# EAGLE design shield due 7 (EAGLE 7.2.0)

## Sheet 1 of 8
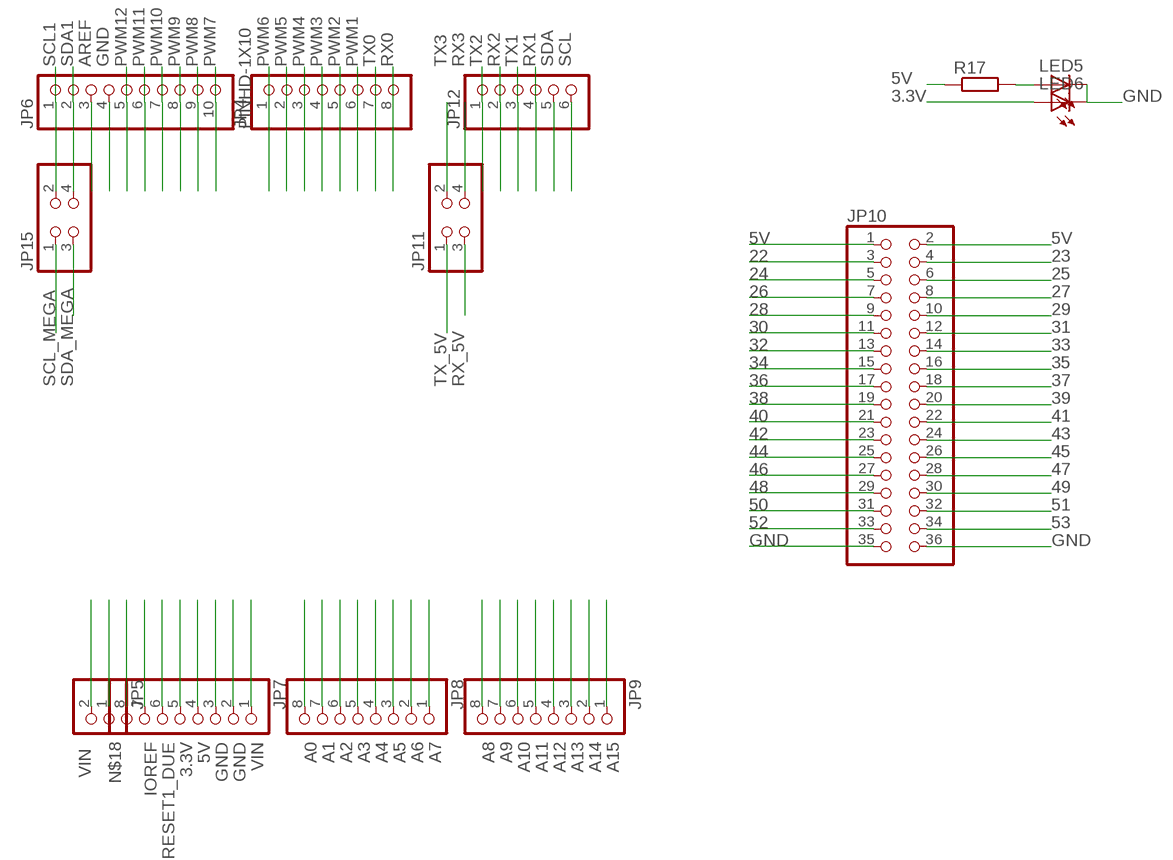
[diagram p0: schematic, sheet 1]

### Parts
JP4  PINHD-1X8  [1X08]
JP5  PINHD-1X2  [1X02]
JP6  PINHD-1X10  [1X10-BIG]
JP7  PINHD-1X8  [1X08]
JP8  PINHD-1X8BIG  [1X08-BIG]
JP9  PINHD-1X8BIG  [1X08-BIG]
JP10  PINHD-2X18  [2X18]
JP11  PINHD-2X2  [2X02]
JP12  PINHD-1X6  [1X06]
JP15  PINHD-2X2  [2X02]
LED5  LEDCHIPLED_0805  [CHIPLED_0805]
LED6  LEDCHIPLED_0805  [CHIPLED_0805]
R17  R-EU_R0805W  [R0805W]

### Nets
3.3V: JP7.5 LED6.A ; also sheet 3,4,7
5V: JP7.4 JP10.1 JP10.2 R17.1 ; also sheet 2,3,4,5,6,8
22: JP10.3
23: JP10.4
24: JP10.5
25: JP10.6
26: JP10.7
27: JP10.8
28: JP10.9
29: JP10.10
30: JP10.11
31: JP10.12
32: JP10.13
33: JP10.14
34: JP10.15
35: JP10.16 ; also sheet 5
36: JP10.17 ; also sheet 5
37: JP10.18 ; also sheet 5
38: JP10.19 ; also sheet 5
39: JP10.20 ; also sheet 5
40: JP10.21 ; also sheet 5
41: JP10.22
42: JP10.23
43: JP10.24
44: JP10.25
45: JP10.26
46: JP10.27
47: JP10.28
48: JP10.29
49: JP10.30
50: JP10.31
51: JP10.32
52: JP10.33
53: JP10.34
A0: JP8.8
A1: JP8.7
A2: JP8.6
A3: JP8.5
A4: JP8.4
A5: JP8.3
A6: JP8.2
A7: JP8.1
A8: JP9.8
A9: JP9.7
A10: JP9.6
A11: JP9.5
A12: JP9.4
A13: JP9.3
A14: JP9.2
A15: JP9.1
AREF: JP6.3
GND: JP6.4 JP7.2 JP7.3 JP10.35 JP10.36 LED5.C LED6.C ; also sheet 2,5,6,7,8
IOREF: JP7.7
N$18: JP7.8
N$21: LED5.A R17.2
PWM1: JP4.6
PWM2: JP4.5
PWM3: JP4.4
PWM4: JP4.3
PWM5: JP4.2
PWM6: JP4.1
PWM7: JP6.10
PWM8: JP6.9
PWM9: JP6.8
PWM10: JP6.7
PWM11: JP6.6
PWM12: JP6.5
RESET1_DUE: JP7.6
RX0: JP4.8
RX1: JP12.4
RX2: JP12.2
RX3: JP11.4 ; also sheet 4
RX_5V: JP11.3 ; also sheet 4
SCL: JP12.6
SCL1: JP6.1 JP15.2 ; also sheet 3
SCL_MEGA: JP15.1 ; also sheet 2,3,8
SDA: JP12.5
SDA1: JP6.2 JP15.4 ; also sheet 3
SDA_MEGA: JP15.3 ; also sheet 2,3,8
TX0: JP4.7
TX1: JP12.3
TX2: JP12.1
TX3: JP11.2 ; also sheet 4
TX_5V: JP11.1 ; also sheet 4
VIN: JP5.2 JP7.1 ; also sheet 2
VIN_BAT: JP5.1 ; also sheet 6,7

## Sheet 2 of 8
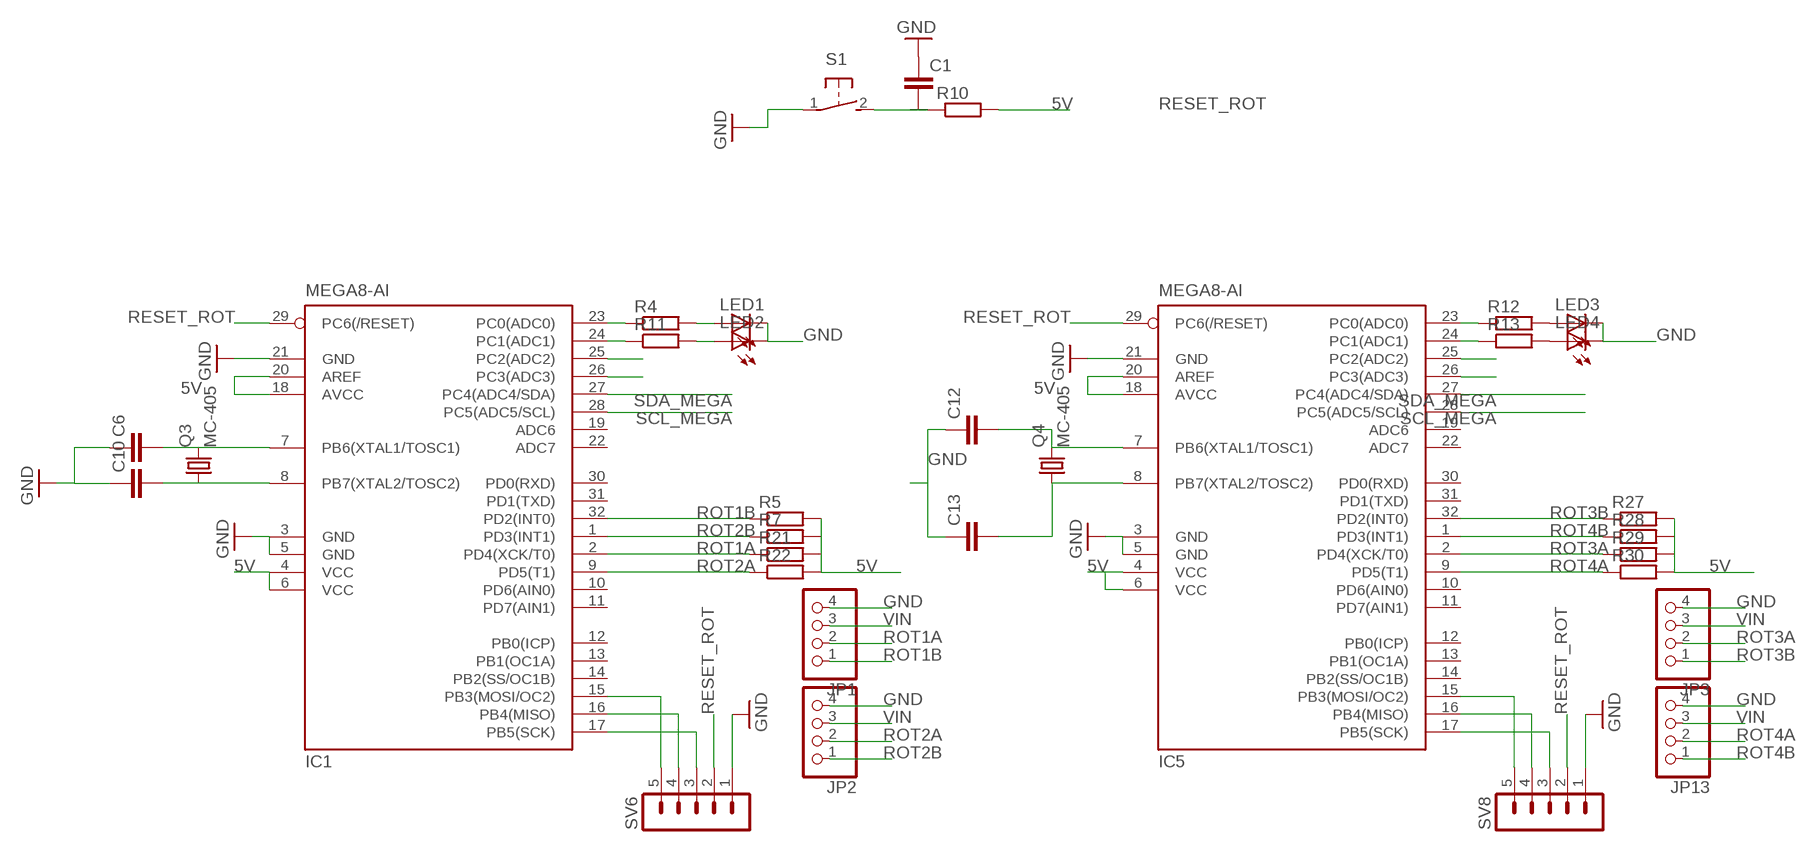
[diagram p1: schematic, sheet 2]

### Parts
C1  C-EUC0805K  [C0805K]
C6  C-EUC0805K  [C0805K]
C10  C-EUC0805K  [C0805K]
C12  C-EUC0805K  [C0805K]
C13  C-EUC0805K  [C0805K]
IC1  MEGA8-AI  [TQFP32-08]
IC5  MEGA8-AI  [TQFP32-08]
JP1  PINHD-1X4  [1X04]
JP2  PINHD-1X4  [1X04]
JP3  PINHD-1X4  [1X04]
JP13  PINHD-1X4  [1X04]
LED1  LEDCHIPLED_0805  [CHIPLED_0805]
LED2  LEDCHIPLED_0805  [CHIPLED_0805]
LED3  LEDCHIPLED_0805  [CHIPLED_0805]
LED4  LEDCHIPLED_0805  [CHIPLED_0805]
Q3  MC-405  [MC-405]
Q4  MC-405  [MC-405]
R4  R-EU_R0805W  [R0805W]
R5  R-EU_R0805W  [R0805W]
R7  R-EU_R0805W  [R0805W]
R10  R-EU_R0805W  [R0805W]
R11  R-EU_R0805W  [R0805W]
R12  R-EU_R0805W  [R0805W]
R13  R-EU_R0805W  [R0805W]
R21  R-EU_R0805W  [R0805W]
R22  R-EU_R0805W  [R0805W]
R27  R-EU_R0805W  [R0805W]
R28  R-EU_R0805W  [R0805W]
R29  R-EU_R0805W  [R0805W]
R30  R-EU_R0805W  [R0805W]
S1  31-XX  [B3F-31XX]
SV6  MA05-1  [MA05-1]
SV8  MA05-1  [MA05-1]

### Nets
5V: IC1.4(VCC) IC1.6(VCC) IC1.18(AVCC) IC1.20(AREF) IC5.4(VCC) IC5.6(VCC) IC5.18(AVCC) IC5.20(AREF) R5.2 R7.2 R10.2 R21.2 R22.2 R27.2 R28.2 R29.2 R30.2 ; also sheet 1,3,4,5,6,8
GND: C1.1 C6.1 C10.1 C12.1 C13.1 IC1.3(GND) IC1.5(GND) IC1.21(GND) IC5.3(GND) IC5.5(GND) IC5.21(GND) JP1.4 JP2.4 JP3.4 JP13.4 LED1.C LED2.C LED3.C LED4.C S1.1(P) SV6.1 SV8.1 ; also sheet 1,5,6,7,8
N$1: C6.2 IC1.7(PB6(XTAL1/TOSC1)) Q3.2
N$2: C10.2 IC1.8(PB7(XTAL2/TOSC2)) Q3.1
N$3: LED3.A R12.2
N$4: LED4.A R13.2
N$5: LED1.A R4.2
N$6: LED2.A R11.2
N$7: IC5.23(PC0(ADC0)) R12.1
N$8: IC1.25(PC2(ADC2))
N$9: IC1.26(PC3(ADC3))
N$10: IC1.17(PB5(SCK)) SV6.3
N$11: IC5.24(PC1(ADC1)) R13.1
N$17: IC1.16(PB4(MISO)) SV6.4
N$23: IC1.15(PB3(MOSI/OC2)) SV6.5
N$24: C12.2 IC5.7(PB6(XTAL1/TOSC1)) Q4.2
N$25: C13.2 IC5.8(PB7(XTAL2/TOSC2)) Q4.1
N$26: IC1.23(PC0(ADC0)) R4.1
N$27: IC1.24(PC1(ADC1)) R11.1
N$28: IC5.25(PC2(ADC2))
N$29: IC5.26(PC3(ADC3))
N$30: IC5.17(PB5(SCK)) SV8.3
N$31: IC5.16(PB4(MISO)) SV8.4
N$32: IC5.15(PB3(MOSI/OC2)) SV8.5
RESET_ROT: C1.2 IC1.29(PC6(/RESET)) IC5.29(PC6(/RESET)) R10.1 S1.2(S) SV6.2 SV8.2
ROT1A: IC1.2(PD4(XCK/T0)) JP1.2 R21.1
ROT1B: IC1.32(PD2(INT0)) JP1.1 R5.1
ROT2A: IC1.9(PD5(T1)) JP2.2 R22.1
ROT2B: IC1.1(PD3(INT1)) JP2.1 R7.1
ROT3A: IC5.2(PD4(XCK/T0)) JP3.2 R29.1
ROT3B: IC5.32(PD2(INT0)) JP3.1 R27.1
ROT4A: IC5.9(PD5(T1)) JP13.2 R30.1
ROT4B: IC5.1(PD3(INT1)) JP13.1 R28.1
SCL_MEGA: IC1.28(PC5(ADC5/SCL)) IC5.28(PC5(ADC5/SCL)) ; also sheet 1,3,8
SDA_MEGA: IC1.27(PC4(ADC4/SDA)) IC5.27(PC4(ADC4/SDA)) ; also sheet 1,3,8
VIN: JP1.3 JP2.3 JP3.3 JP13.3 ; also sheet 1
Unconnected: IC1.10(PD6(AIN0)) IC1.11(PD7(AIN1)) IC1.12(PB0(ICP)) IC1.13(PB1(OC1A)) IC1.14(PB2(SS/OC1B)) IC1.19(ADC6) IC1.22(ADC7) IC1.30(PD0(RXD)) IC1.31(PD1(TXD)) IC5.10(PD6(AIN0)) IC5.11(PD7(AIN1)) IC5.12(PB0(ICP)) IC5.13(PB1(OC1A)) IC5.14(PB2(SS/OC1B)) IC5.19(ADC6) IC5.22(ADC7) IC5.30(PD0(RXD)) IC5.31(PD1(TXD))

## Sheet 3 of 8
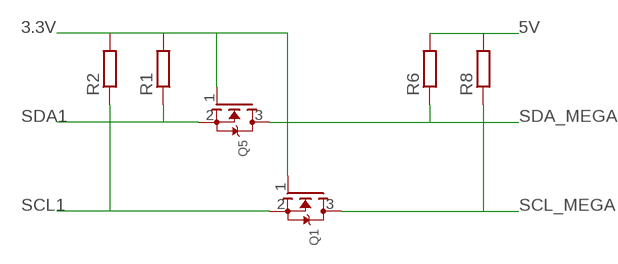
[diagram p2: schematic, sheet 3]

### Parts
Q1  MOSFET-NWAVE  [SOT23-W]
Q5  MOSFET-NWAVE  [SOT23-W]
R1  R-EU_R0805W  [R0805W]
R2  R-EU_R0805W  [R0805W]
R6  R-EU_R0805W  [R0805W]
R8  R-EU_R0805W  [R0805W]

### Nets
3.3V: Q1.1(G) Q5.1(G) R1.2 R2.2 ; also sheet 1,4,7
5V: R6.2 R8.2 ; also sheet 1,2,4,5,6,8
SCL1: Q1.2(S) R2.1 ; also sheet 1
SCL_MEGA: Q1.3(D) R8.1 ; also sheet 1,2,8
SDA1: Q5.2(S) R1.1 ; also sheet 1
SDA_MEGA: Q5.3(D) R6.1 ; also sheet 1,2,8

## Sheet 4 of 8
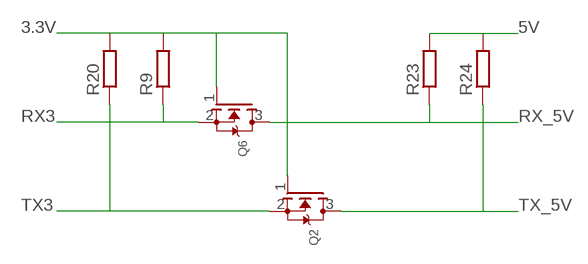
[diagram p3: schematic, sheet 4]

### Parts
Q2  MOSFET-NWAVE  [SOT23-W]
Q6  MOSFET-NWAVE  [SOT23-W]
R9  R-EU_R0805W  [R0805W]
R20  R-EU_R0805W  [R0805W]
R23  R-EU_R0805W  [R0805W]
R24  R-EU_R0805W  [R0805W]

### Nets
3.3V: Q2.1(G) Q6.1(G) R9.2 R20.2 ; also sheet 1,3,7
5V: R23.2 R24.2 ; also sheet 1,2,3,5,6,8
RX3: Q6.2(S) R9.1 ; also sheet 1
RX_5V: Q6.3(D) R23.1 ; also sheet 1
TX3: Q2.2(S) R20.1 ; also sheet 1
TX_5V: Q2.3(D) R24.1 ; also sheet 1

## Sheet 5 of 8
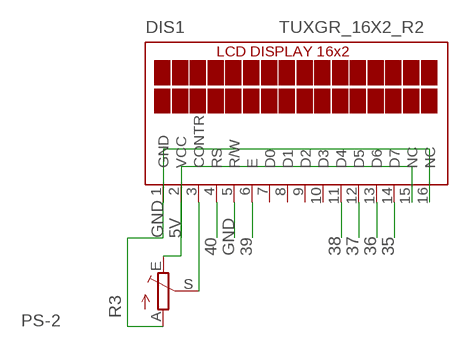
[diagram p4: schematic, sheet 5]

### Parts
DIS1  TUXGR_16X2_R2  [TUXGR_16X2_R2]
R3  TRIM_EU-CA6V  [CA6V]

### Nets
5V: DIS1.2(VCC) DIS1.15(NC) R3.E ; also sheet 1,2,3,4,6,8
35: DIS1.14(D7) ; also sheet 1
36: DIS1.13(D6) ; also sheet 1
37: DIS1.12(D5) ; also sheet 1
38: DIS1.11(D4) ; also sheet 1
39: DIS1.6(E) ; also sheet 1
40: DIS1.4(RS) ; also sheet 1
GND: DIS1.1(GND) DIS1.5(R/W) DIS1.16(NC) R3.A ; also sheet 1,2,6,7,8
N$13: DIS1.3(CONTR) R3.S
Unconnected: DIS1.7(D0) DIS1.8(D1) DIS1.9(D2) DIS1.10(D3)

### Notes on the sheet
- PS-2

## Sheet 6 of 8
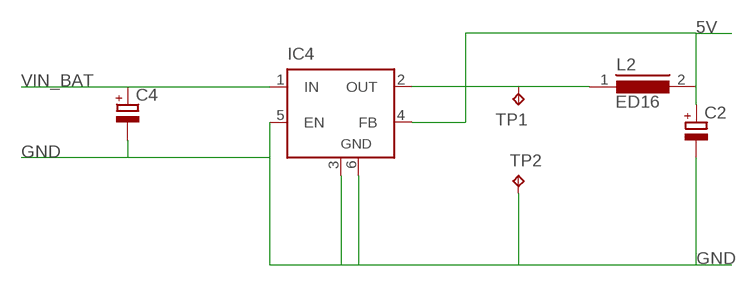
[diagram p5: schematic, sheet 6]

### Parts
C2  CPOL-EU150CLZ-1010  [150CLZ-1010]
C4  CPOL-EU153CLV-1014  [153CLV-1014]
IC4  LM2596S  [TO263-5]
L2  ED16  [ED16]
TP1  TPPAD1-13  [P1-13]
TP2  TPPAD1-13  [P1-13]

### Nets
5V: C2.+ IC4.4(FB) L2.2 ; also sheet 1,2,3,4,5,8
A: IC4.2(OUT) L2.1 TP1.TP
GND: C2.- C4.- IC4.3(GND) IC4.5(EN) IC4.6(GND) TP2.TP ; also sheet 1,2,5,7,8
VIN_BAT: C4.+ IC4.1(IN) ; also sheet 1,7

## Sheet 7 of 8
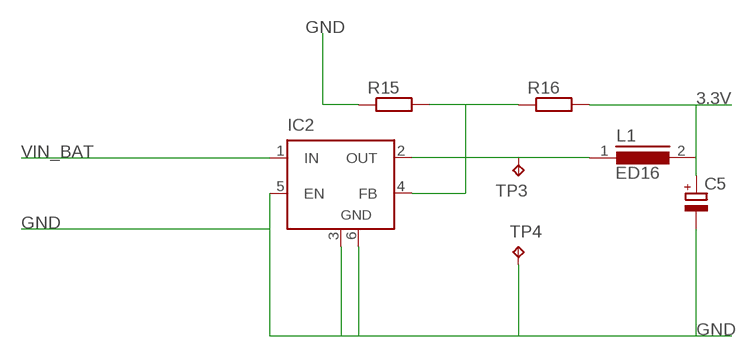
[diagram p6: schematic, sheet 7]

### Parts
C5  CPOL-EU150CLZ-1010  [150CLZ-1010]
IC2  LM2596S  [TO263-5]
L1  ED16  [ED16]
R15  R-EU_R0805W  [R0805W]
R16  R-EU_R0805W  [R0805W]
TP3  TPPAD1-13  [P1-13]
TP4  TPPAD1-13  [P1-13]

### Nets
3.3V: C5.+ L1.2 R16.2 ; also sheet 1,3,4
A16: IC2.2(OUT) L1.1 TP3.TP
GND: C5.- IC2.3(GND) IC2.5(EN) IC2.6(GND) R15.1 TP4.TP ; also sheet 1,2,5,6,8
SADSA: IC2.4(FB) R15.2 R16.1
VIN_BAT: IC2.1(IN) ; also sheet 1,6

## Sheet 8 of 8
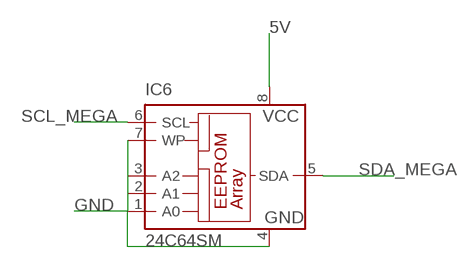
[diagram p7: schematic, sheet 8]

### Parts
IC6  24C64SM  [SO-08M]

### Nets
5V: IC6.8(VCC) ; also sheet 1,2,3,4,5,6
GND: IC6.1(A0) IC6.2(A1) IC6.3(A2) IC6.4(GND) IC6.7(WP) ; also sheet 1,2,5,6,7
SCL_MEGA: IC6.6(SCL) ; also sheet 1,2,3
SDA_MEGA: IC6.5(SDA) ; also sheet 1,2,3

## Library data of the parts
C1 C6 C10 C12 C13 = rcl:C-EU: CAPACITOR, European symbol
C2 C4 C5 = resistor:CPOL-EU: POLARIZED CAPACITOR, European symbol
DIS1 = display-lcd:TUXGR_16X2_R2: Tuxgraphics LCD display 16x2 characters reflective, without background light Source: tuxgr_12x2_r2.pdf; OC_FARNELL: unknown; OC_NEWARK: unknown
IC1 IC5 = atmel:MEGA8: MICROCONTROLLER 8 Kbytes FLASH, 1 kbytes SRAM, 512 bytes EEPROM, USART, 6-channel 10 bit ADC, 2-channel 8 bit ADC Pin compatible with Atmega48, ATMega88, ATMega168 Source: avr.lbr; MPN: ATMEGA8-16AU; OC_FARNELL: 9171371; OC_NEWARK: 73M8863
IC2 IC4 = linear:LM2596S: STEP-DOWN VOLTAGE REGULATOR
IC6 = microchip:24*: Serial EEPROM I2C; MF: RAMTRON INTERNATIONAL CORP; MPN: FM24C64-S; OC_FARNELL: 9882685; OC_NEWARK: 98H0189
JP1-JP3 JP13 = pinhead:PINHD-1X4: PIN HEADER
JP4 JP7 = pinhead:PINHD-1X8: PIN HEADER
JP5 = pinhead:PINHD-1X2: PIN HEADER
JP6 = adafruit:PINHD-1X10: Pin header 1x10 0.1" spacing With round pins
JP8 JP9 = adafruit:PINHD-1X8: PIN HEADER
JP10 = pinhead:PINHD-2X18: PIN HEADER
JP11 JP15 = pinhead:PINHD-2X2: PIN HEADER
JP12 = pinhead:PINHD-1X6: PIN HEADER
L1 L2 = inductors:ED16: INDUCTOR
LED1-LED6 = led:LED: LED OSRAM: - CHIPLED LG R971, LG N971, LY N971, LG Q971, LY Q971, LO R971, LY R971 LH N974, LH R974 LS Q976, LO Q976, LY Q976 LO Q996 - Hyper CHIPLED LW Q18S LB Q993, LB Q99A, LB R99A - SideLED LS A670, LO A670, LY A670, LG A670, LP A670 LB A673, LV A673, LT A673, LW A673 LH A674 LY A675 LS A676, LA A676, LO A676, LY A676, LW A676 LS A679, LY A679, LG A679 - Hyper Micro SIDELED® LS Y876, LA Y876, LO Y876, LY Y876 LT Y87S - SmartLED LW L88C, LW L88S LB L89C, LB L89S, LG L890 LS L89K, LO L89K, LY L89K LS L896, LA L896, LO L896, LY L896 - TOPLED LS T670, LO T670, LY T670, LG T670, LP T670 LSG T670, LSP T670, LSY T670, LOP T670, LYG T670 LG T671, LOG T671, LSG T671 LB T673, LV T673, LT T673, LW T673 LH T674 LS T676, LA T676, LO T676, LY T676, LB T676, LH T676, LSB T676, LW T676 LB T67C, LV T67C, LT T67C, LS T67K, LO T67K, LY T67K, LW E67C LS E67B, LA E67B, LO E67B, LY E67B, LB E67C, LV E67C, LT E67C LW T67C LS T679, LY T679, LG T679 LS T770, LO T770, LY T770, LG T770, LP T770 LB T773, LV T773, LT T773, LW T773 LH T774 LS E675, LA E675, LY E675, LS T675 LS T776, LA T776, LO T776, LY T776, LB T776 LHGB T686 LT T68C, LB T68C - Hyper Mini TOPLED® LB M676 - Mini TOPLED Santana® LG M470 LS M47K, LO M47K, LY M47K Source: http://www.osram.convergy.de LUXEON: - LUMILED® LXK2-PW12-R00, LXK2-PW12-S00, LXK2-PW14-U00, LXK2-PW14-V00 LXK2-PM12-R00, LXK2-PM12-S00, LXK2-PM14-U00 LXK2-PE12-Q00, LXK2-PE12-R00, LXK2-PE12-S00, LXK2-PE14-T00, LXK2-PE14-U00 LXK2-PB12-K00, LXK2-PB12-L00, LXK2-PB12-M00, LXK2-PB14-N00, LXK2-PB14-P00, LXK2-PB14-Q00 LXK2-PR12-L00, LXK2-PR12-M00, LXK2-PR14-Q00, LXK2-PR14-R00 LXK2-PD12-Q00, LXK2-PD12-R00, LXK2-PD12-S00 LXK2-PH12-R00, LXK2-PH12-S00 LXK2-PL12-P00, LXK2-PL12-Q00, LXK2-PL12-R00 Source: www.luxeon.com KINGBRIGHT: KA-3528ASYC Source: www.kingbright.com
Q1 Q2 Q5 Q6 = adafruit:MOSFET-N: N-Channel Mosfet 2N7002E - 60V 260mA SOT23 [Digikey: 2N7002ET1GOSTR-ND] - REEL BSH103 - 30V 850mA SOT23 [Digikey: 568-5013-1-ND]
Q3 Q4 = crystal:MC-405: kHz RANGE CRYSTAL UNIT SMD Source: MC-306_405_406_E07X.PDF Homepage <http://www.epsontoyocom.co.jp>; OC_FARNELL: unknown; OC_NEWARK: unknown
R1 R2 R4-R13 R17 R20-R24 R27-R30 = resistor:R-EU_: RESISTOR, European symbol
R3 = pot:TRIM_EU-: POTENTIOMETER
R15 R16 = rcl:R-EU_: RESISTOR, European symbol
S1 = switch-omron:31-XX: OMRON SWITCH; MPN: B3F-3100; OC_FARNELL: 959704; OC_NEWARK: 36M3582
SV6 SV8 = con-lstb:MA05-1: PIN HEADER; OC_FARNELL: unknown; OC_NEWARK: unknown
TP1-TP4 = testpad:TP: Test pad

## Board
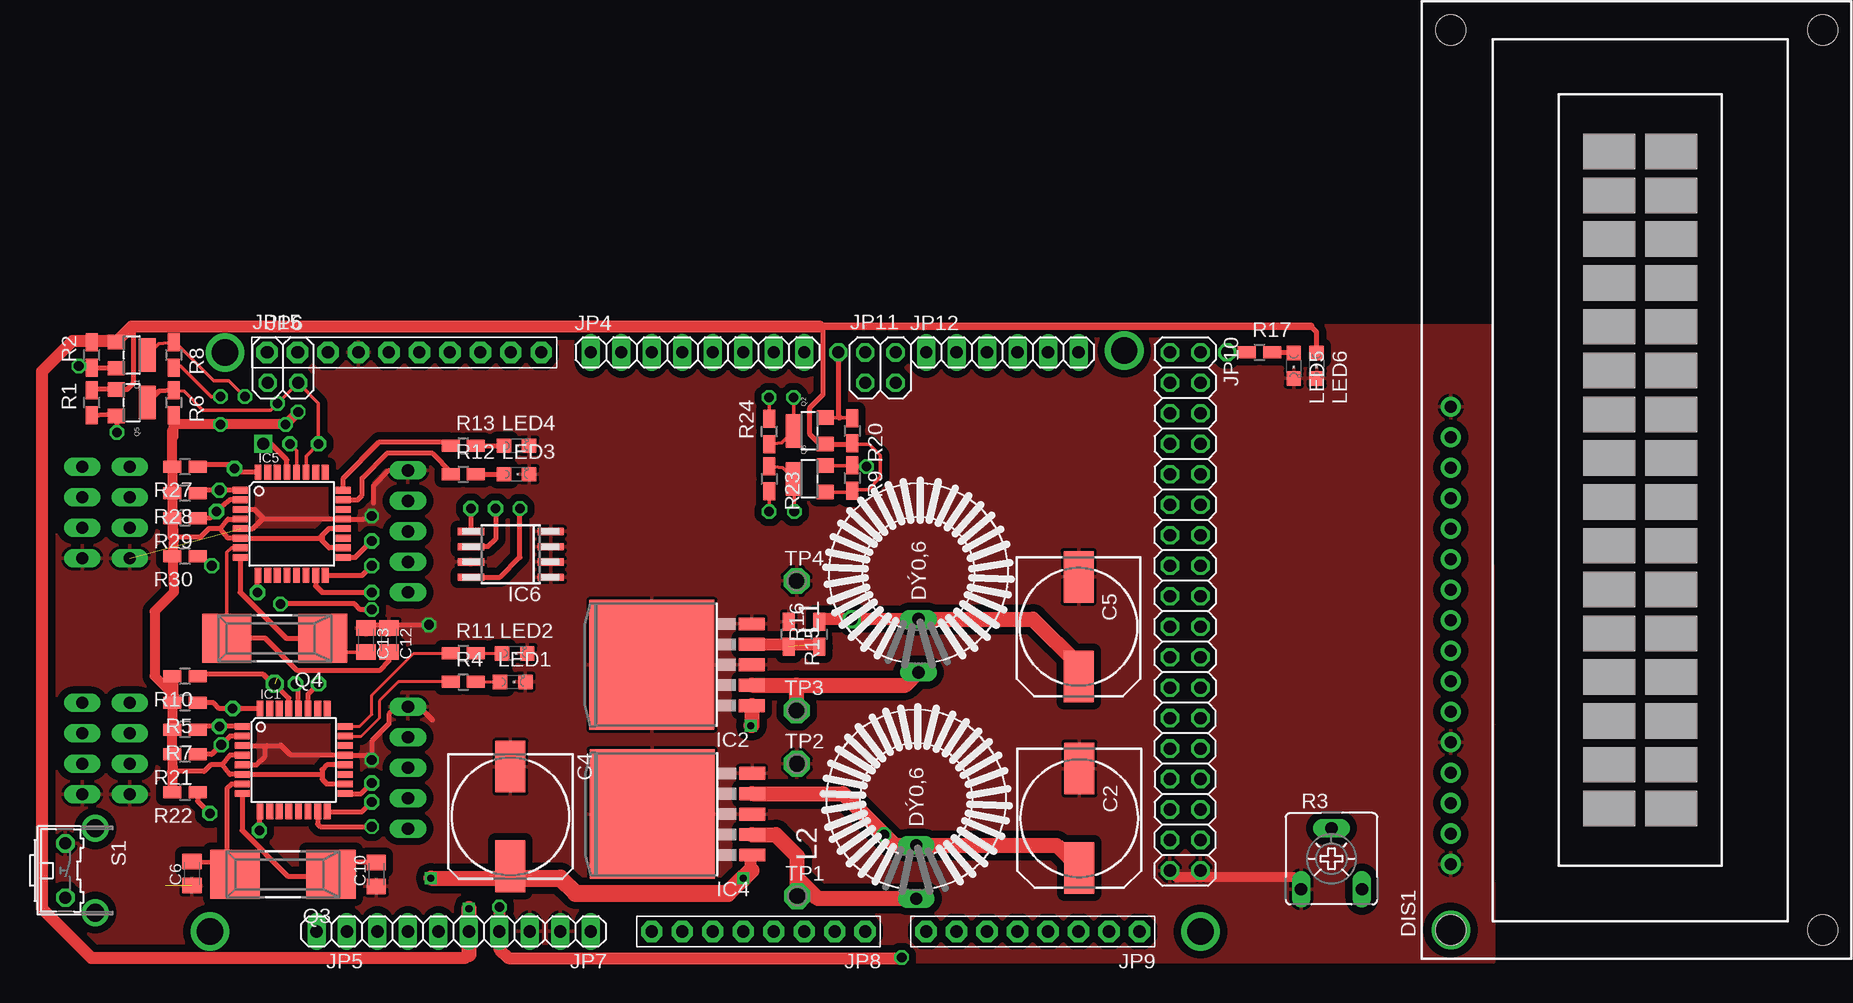
[diagram p8: board, top side]
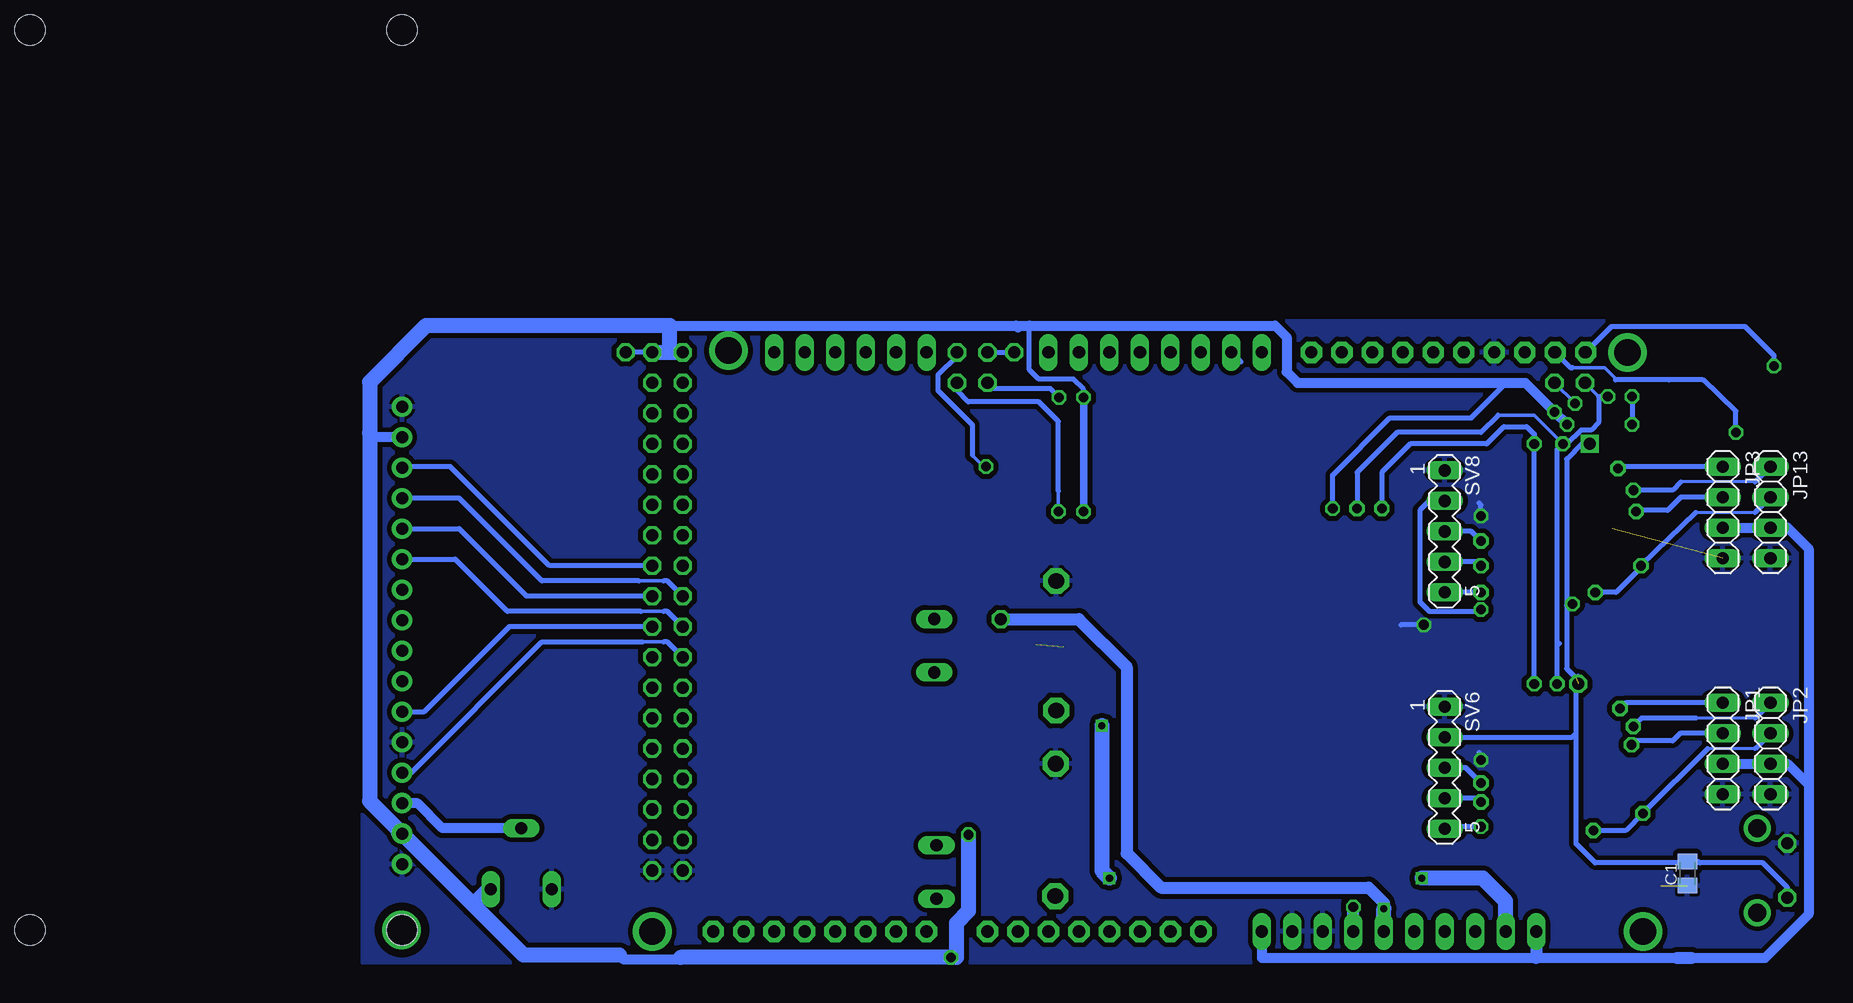
[diagram p9: board, bottom side, seen from below]

No outline drawn. Coordinates in mm, seen from the top.
Copper layers (1*16): Top 0.035mm / dielectric 1.5mm / Bottom 0.035mm
Design rules "default": minimum track width 10mil, minimum drill 24mil, track to track 8mil, track to pad 8mil, pad to pad 8mil, via to via 8mil, smd to smd 8mil, copper to edge 40mil, drill to drill 8mil, minimum pad ring 10mil, minimum via ring 8mil, stop-mask expansion 4mil, vias tented up to drill 0mil, thermal gap 10mil

### Footprints (pad centres in the part's own frame; a part is rotated, then mirrored left to right if it is on the bottom)
C0805K = smd 1.3 x 1.6: 1 -1,0; 2 1,0
150CLZ-1010 = smd 4.3 x 2.5: + 4.15,0; - -4.15,0
153CLV-1014 = smd 4.3 x 2.5: + 4.15,0; - -4.15,0
TUXGR_16X2_R2 = drill 1 pad 1.676: 1 -32,15.5; 2 -29.46,15.5; 3 -26.92,15.5; 4 -24.38,15.5; 5 -21.84,15.5; 6 -19.3,15.5; 7 -16.76,15.5; 8 -14.22,15.5; 9 -11.68,15.5; 10 -9.14,15.5; 11 -6.6,15.5; 12 -4.06,15.5; 13 -1.52,15.5; 14 1.02,15.5; 15 3.56,15.5; 16 6.1,15.5 | hole 2.5: -37.5,-15.5; 37.5,-15.5; -37.5,15.5; 37.5,15.5
TQFP32-08 = smd 1.27 x 0.559: 1 -4.293,2.8; 2 -4.293,2; 3 -4.293,1.2; 4 -4.293,0.4; 5 -4.293,-0.4; 6 -4.293,-1.2; 7 -4.293,-2; 8 -4.293,-2.8; 17 4.293,-2.8; 18 4.293,-2; 19 4.293,-1.2; 20 4.293,-0.4; 21 4.293,0.4; 22 4.293,1.2; 23 4.293,2; 24 4.293,2.8 | smd 0.559 x 1.27: 9 -2.8,-4.293; 10 -2,-4.293; 11 -1.2,-4.293; 12 -0.4,-4.293; 13 0.4,-4.293; 14 1.2,-4.293; 15 2,-4.293; 16 2.8,-4.293; 25 2.8,4.293; 26 2,4.293; 27 1.2,4.293; 28 0.4,4.293; 29 -0.4,4.293; 30 -1.2,4.293; 31 -2,4.293; 32 -2.8,4.293
TO263-5 = smd 1.067 x 2.159: 1 -3.404,-5.791; 2 -1.702,-5.791; 3 0,-5.791; 4 1.702,-5.791; 5 3.404,-5.791 | smd 10.8 x 10.41: 6 0,2.54
SO-08M = smd 0.6 x 2.2: 1 -1.905,-3.33; 2 -0.635,-3.33; 3 0.635,-3.33; 4 1.905,-3.33; 5 1.905,3.33; 6 0.635,3.33; 7 -0.635,3.33; 8 -1.905,3.33
1X04 = drill 1.016 long: 1 -3.81,0; 2 -1.27,0; 3 1.27,0; 4 3.81,0
1X08 = drill 1.016 long: 1 -8.89,0; 2 -6.35,0; 3 -3.81,0; 4 -1.27,0; 5 1.27,0; 6 3.81,0; 7 6.35,0; 8 8.89,0
1X02 = drill 1.016 long: 1 -1.27,0; 2 1.27,0
1X10-BIG = drill 1.016 pad 1.778 octagon: 1 -11.43,0; 2 -8.89,0; 3 -6.35,0; 4 -3.81,0; 5 -1.27,0; 6 1.27,0; 7 3.81,0; 8 6.35,0; 9 8.89,0; 10 11.43,0
1X08-BIG = drill 1.016 pad 1.778 octagon: 1 -8.89,0; 2 -6.35,0; 3 -3.81,0; 4 -1.27,0; 5 1.27,0; 6 3.81,0; 7 6.35,0; 8 8.89,0
2X18 = drill 1.016 octagon: 1 -21.59,-1.27; 2 -21.59,1.27; 3 -19.05,-1.27; 4 -19.05,1.27; 5 -16.51,-1.27; 6 -16.51,1.27; 7 -13.97,-1.27; 8 -13.97,1.27; 9 -11.43,-1.27; 10 -11.43,1.27; 11 -8.89,-1.27; 12 -8.89,1.27; 13 -6.35,-1.27; 14 -6.35,1.27; 15 -3.81,-1.27; 16 -3.81,1.27; 17 -1.27,-1.27; 18 -1.27,1.27; 19 1.27,-1.27; 20 1.27,1.27; 21 3.81,-1.27; 22 3.81,1.27; 23 6.35,-1.27; 24 6.35,1.27; 25 8.89,-1.27; 26 8.89,1.27; 27 11.43,-1.27; 28 11.43,1.27; 29 13.97,-1.27; 30 13.97,1.27; 31 16.51,-1.27; 32 16.51,1.27; 33 19.05,-1.27; 34 19.05,1.27; 35 21.59,-1.27; 36 21.59,1.27
2X02 = drill 1.016 octagon: 1 -1.27,-1.27; 2 -1.27,1.27; 3 1.27,-1.27; 4 1.27,1.27
1X06 = drill 1.016 long: 1 -6.35,0; 2 -3.81,0; 3 -1.27,0; 4 1.27,0; 5 3.81,0; 6 6.35,0
ED16 = drill 1.016 long: 1 -8.255,0; 2 -3.81,0
CHIPLED_0805 = smd 1.2 x 1.2: A 0,-1.05; C 0,1.05
SOT23-W = smd 1.2 x 1.4: 1 -1.1,-1.3; 2 1.1,-1.3 | smd 2.8 x 1.4: 3 0,1.3
MC-405 = smd 4.1 x 4.1: 1 -4,0; 2 4,0
R0805W = smd 1.5 x 1: 1 -1.052,0; 2 1.052,0
CA6V = drill 1.016 long: A -2.54,-2.54; E 2.54,-2.54; S 0,2.54
B3F-31XX = drill 1.016 octagon: 1 -2.261,-1.245; 2 2.261,-1.245 | drill 1.499 pad 2.159: 3 -3.505,1.245; 4 3.505,1.245
MA05-1 = drill 1.016 long: 1 -5.08,0; 2 -2.54,0; 3 0,0; 4 2.54,0; 5 5.08,0
P1-13 = drill 1.321 pad 2.159 octagon: TP 0,0

### Placement (x,y rotation side)
C1  -35.46,-85.34 90 bottom
C2  40.7,-80.74 270 top
C4  -6.7,-80.58 270 top
C5  40.64,-64.77 270 top
C6  -33.24,-85.34 90 top
C10  -17.88,-85.41 90 top
C12  -16.83,-65.88 270 top
C13  -18.73,-65.88 270 top
DIS1  87.15,-52.55 90 top
IC1  -24.77,-75.88 0 top
IC2  7.62,-67.94 90 top
IC4  7.65,-80.39 90 top
IC5  -24.92,-56.2 0 top
IC6  -6.67,-58.74 90 top
JP1  -38.42,-74.93 270 bottom
JP2  -42.39,-74.93 270 bottom
JP3  -38.42,-55.24 270 bottom
JP4  8.89,-41.91 0 top
JP5  -21.59,-90.17 180 top
JP6  -15.56,-41.91 0 top
JP7  -8.89,-90.17 180 top
JP8  13.97,-90.17 180 top
JP9  36.83,-90.17 180 top
JP10  49.53,-63.5 270 top
JP11  24.13,-43.18 0 top
JP12  34.29,-41.91 0 top
JP13  -42.39,-55.24 270 bottom
JP15  -25.65,-43.18 0 top
L1  27.3,-60.33 90 top
L2  27.11,-79.18 90 top
LED1  -6.51,-69.37 270 top
LED2  -6.35,-66.99 270 top
LED3  -6.19,-52.07 270 top
LED4  -6.19,-49.69 270 top
LED5  58.58,-43.02 180 top
LED6  60.48,-43.02 180 top
Q1  -38.26,-42.13 270 top
Q2  18.22,-48.45 90 top
Q3  -25.65,-85.41 180 top
Q4  -26.35,-65.72 180 top
Q5  -38.26,-46.1 270 top
Q6  18.22,-52.45 90 top
R1  -41.59,-46.1 90 top
R2  -41.59,-42.13 90 top
R3  61.72,-84.11 0 top
R4  -10.64,-69.37 0 top
R5  -33.81,-71.12 180 top
R6  -34.77,-46.1 270 top
R7  -33.81,-73.34 180 top
R8  -34.77,-42.13 270 top
R9  21.78,-52.39 270 top
R10  -33.81,-68.9 180 top
R11  -10.64,-66.99 0 top
R12  -10.64,-52.07 0 top
R13  -10.64,-49.69 0 top
R15  16.51,-65.41 270 top
R16  19.05,-65.41 90 top
R17  55.72,-41.91 0 top
R20  21.78,-48.45 270 top
R21  -33.81,-75.41 180 top
R22  -33.81,-78.58 180 top
R23  14.86,-52.45 270 top
R24  14.86,-48.51 90 top
R27  -33.81,-51.44 180 top
R28  -33.81,-53.66 180 top
R29  -33.81,-55.72 180 top
R30  -33.81,-58.9 180 top
S1  -42.55,-85.09 270 top
SV6  -15.24,-76.52 270 bottom
SV8  -15.24,-56.83 270 bottom
TP1  17.21,-87.22 0 top
TP2  17.18,-76.2 0 top
TP3  17.14,-71.75 0 top
TP4  17.14,-60.96 0 top

### Tracks (layer width: path | path; a pad name or v marks a point on that pad's centre or on a via)
3.3V  (via drill 0.6, 1)
  Top 0.305: Q6.1 21.56,-53.55 R9.2 21.79,-53.34 23.11,-53.34 24.13,-52.32 24.13,-50.48 23.2,-49.55 21.62,-49.55 R20.2
  Top 0.406: Q1.1 -41.43,-41.03 R2.2 | R1.2 -41.43,-45 Q5.1 -38.65,-45 -38.1,-44.45 -38.1,-40.32 -38.47,-39.95 | -45.72,-45 -45.72,-45.09 | 19.05,-39.75 19.37,-40.07 19.37,-45.4 18.26,-46.51 18.26,-48.74 19.07,-49.55 Q2.1 21.73,-49.55 R20.2 | LED6.A 60.48,-40.23 60.01,-39.75
  Top 0.61: 19.05,-39.75 60.01,-39.75
  Top 1.016: 19.05,-39.75 -38.28,-39.75 -38.47,-39.95 Q1.1 -39.63,-40.96 -43.18,-40.96 -45.72,-43.5 -45.72,-45.09 -45.72,-88.27 -41.59,-92.39 -10.48,-92.39 -10.16,-92.08 | L1.2 v21.75,-64.14 19.27,-64.14 R16.2
  Top 1.27: L1.2 36.83,-64.14 40.64,-67.94 C5.+ | v-10.16,-88.27 -10.16,-92.08
  Bottom 1.016: v21.75,-64.14 15.24,-64.14 11.27,-68.1 11.27,-83.66 8.41,-86.52 -8.89,-86.52 -10.16,-87.79 -10.16,-89.38
  Bottom 1.27: JP7.5 -10.16,-89.38 v-10.16,-88.27
5V  (via drill 0.8, 1)
  Top 0.305: R8.2 -34.16,-43.07 -31.64,-45.59 v-30.86,-45.59 | R24.2 v14.86,-45.66 | v14.86,-55.18 R23.2
  Top 0.406: IC1.4 -30.08,-75.48 -30.72,-76.28 | -30.88,-56.59 -30.24,-55.8 IC5.4 | IC5.20 -21.83,-56.6 -22.38,-57.15 -22.38,-57.47 | -22.38,-57.47 -22.38,-57.63 -21.81,-58.2 IC5.18 | -22.38,-57.47 -22.54,-57.31 -22.63,-57.4 IC5.6 -30.23,-57.4 -30.88,-56.59 | -30.72,-76.28 -30.07,-77.08 IC1.6 -22.47,-77.08 -22.38,-76.99 | -30.72,-76.28 -31.67,-76.28 -32.23,-76.83 -34.47,-76.83 -34.83,-76.48 | IC1.20 -21.99,-76.28 -22.38,-76.68 -22.38,-76.99 | -22.38,-76.99 -22.38,-77.47 -21.97,-77.88 IC1.18 | -30.88,-56.59 -31.83,-56.59 -32.54,-57.31 -34.59,-57.31 -34.75,-57.47 | IC6.8 -7.56,-60.64 -5.91,-58.99 v-5.91,-54.93 | v53.02,-41.91 R17.1
  Top 0.813: R22.2 -34.87,-76.99 -34.83,-76.48 R21.2 R7.2 R5.2 -34.75,-70.5 -36.35,-68.9 -36.35,-63.5 -34.75,-61.9 R30.2 -34.75,-57.47 R29.2 | R29.2 R28.2 R27.2 -34.87,-48.36 -34.77,-48.26 | R29.2 -34.87,-57.31 | -34.91,-49.05 -34.77,-48.91 -34.77,-48.26 | -34.77,-48.26 -34.77,-47.56 | -34.77,-47.56 R6.2 | -34.77,-47.56 -34.73,-47.91 v-30.86,-47.91 v-25.43,-47.91 v-24.38,-46.86
  Top 1.016: R10.2 R5.2 | v25.91,-92.33 25.84,-92.39 -6.86,-92.39 -7.62,-91.63 v-7.62,-88.14
  Top 1.27: IC4.4 21.03,-78.69 v24.45,-82.11 25.34,-83 L2.2 38.81,-83 C2.+
  Bottom 0.406: -20.38,-44.45 -17.46,-47.37 -10.67,-47.37 -5.91,-52.13 v-5.91,-54.93 | v-30.86,-45.59 v-30.86,-47.91 | 74.3,-48.9 74.36,-48.83 74.36,-48.64 | v14.86,-45.66 14.86,-44.99 15.72,-44.13 18.57,-44.13 19.37,-43.34 19.37,-39.69 | JP10.2 v53.02,-41.91
  Bottom 0.61: v14.86,-45.66 v14.86,-55.18
  Bottom 0.813: 49.34,-39.69 20.48,-39.69 | 20.48,-39.69 19.37,-39.69 -1.11,-39.69 -2.06,-40.64 -2.06,-43.53 -2.98,-44.45 -20.38,-44.45 -21.97,-44.45 v-24.38,-46.86 | DIS1.2 72.14,-82.01 | DIS1.15 74.2,-48.99 74.3,-48.9 | 20.32,-39.85 20.48,-39.69 | v-24.38,-46.86 v-25.43,-47.91 | v-24.38,-46.86 -24.38,-46.93 | 48.45,-92.33 48.64,-92.52 53.15,-92.52 53.53,-92.14
  Bottom 1.016: JP7.4 v-7.62,-88.14
  Bottom 1.27: 49.34,-41.91 49.34,-39.69 69.66,-39.69 74.36,-44.39 74.36,-48.64 74.36,-79.3 DIS1.2 65.72,-87.94 | 49.34,-41.91 JP10.1 | JP10.2 49.34,-41.91 | v24.45,-82.11 24.45,-88.46 25.46,-89.47 25.46,-92.33 v25.91,-92.33 48.45,-92.33 | 65.72,-87.94 61.52,-92.14 53.53,-92.14 | R3.E 64.42,-86.65 65.72,-87.94
35
  Bottom 0.406: JP10.16 59.37,-59.69 67.63,-51.44 71.56,-51.44 DIS1.14
36
  Bottom 0.305: 49.85,-60.96 51.91,-60.96
  Bottom 0.406: JP10.17 49.53,-60.96 49.85,-60.96 | 51.91,-60.96 60.01,-60.96 66.9,-54.07 DIS1.13
37
  Bottom 0.406: JP10.18 61.28,-62.23 66.9,-56.61 DIS1.12
38
  Bottom 0.305: 49.85,-63.5 51.75,-63.5
  Bottom 0.406: JP10.19 49.53,-63.5 49.85,-63.5 | 51.75,-63.5 62.87,-63.5 67.22,-59.15 DIS1.11
39
  Bottom 0.406: JP10.20 62.71,-64.77 69.78,-71.85 DIS1.6
40
  Bottom 0.305: 49.85,-66.04 51.59,-66.04
  Bottom 0.406: JP10.21 49.53,-66.04 49.85,-66.04 | DIS1.4 70.89,-76.93 60.01,-66.04 51.59,-66.04
A
  Top 1.27: 13.49,-82.14 IC4.2 15.42,-82.09 17.21,-83.88 17.21,-85.72 | TP1.TP 17.21,-85.72 | L2.1 18.92,-87.44 17.21,-85.72
A16
  Top 1.27: IC2.2 17.14,-69.65 | 17.14,-69.65 26.24,-69.65 L1.1 | TP3.TP 17.14,-69.65
GND  (via drill 0.8)  (2 unrouted)
  Top 0.406: -25.81,-74.68 -25.88,-74.61 | IC1.3 -26.99,-74.68 | -26.99,-74.68 -25.81,-74.68 | IC5.3 -28.03,-55 -27.3,-55.72 | IC5.5 -28.18,-56.6 -27.3,-55.72 | -27.3,-55.72 -27.23,-55.8 IC5.21 -18.97,-55.8 v-18.26,-55.56 | -18.1,-54.45 -18.1,-53.02 -16.83,-51.75 SV8.1 | IC1.5 -27.86,-76.28 -27.15,-75.56 -27.15,-74.84 -26.99,-74.68 | -25.81,-74.68 -25.01,-75.48 IC1.21 -18.66,-75.48 v-18.26,-75.88 -18.26,-74.3 -16.83,-72.87 -16.83,-72.07 -16.19,-71.44 SV6.1 -14.29,-71.44 -13.18,-72.55 | C13.1 -18.46,-64.61 v-13.49,-64.61
  Top 0.813: 58.67,-85.66 48.83,-85.66 JP10.35
  Bottom 0.406: v-18.26,-75.88 -18.26,-75.41 -18.1,-75.25 | v-18.26,-55.56 -18.26,-54.61 -18.1,-54.45 | v-13.49,-64.61 -11.59,-64.61
  pour Bottom (isolate 0.406): -45.72,-39.37 74.93,-39.37 74.93,-92.71 -45.72,-92.71
  pour Top (isolate 0.61): 75.09,-39.69 75.25,-92.71 -45.56,-92.71 -45.72,-39.37
N$1
  Top 0.406: IC1.7 -29.94,-77.88 -30.32,-78.26 -30.32,-84.3 | -30.32,-84.3 -30.32,-85.38 Q3.2 -31.35,-84.41 C6.2 | -30.37,-84.34 -30.32,-84.3
N$2
  Top 0.406: IC1.8 -29.06,-81.75 -25.24,-85.57 -22.86,-85.57 | -22.86,-85.57 -22.51,-85.57 Q3.1 | C10.2 -21.7,-84.41 -22.86,-85.57
N$3
  Top 0.406: R12.2 LED3.A
N$4
  Top 0.406: R13.2 LED4.A
N$5
  Top 0.254: R4.2 LED1.A
N$6
  Top 0.254: R11.2 LED2.A
N$7
  Top 0.406: R12.1 -11.58,-51.92 -13.18,-50.32 -16.99,-50.32 -19.05,-52.39 -19.05,-53.82 -19.43,-54.2 IC5.23
N$10  (via drill 0.8 pad 1.27)
  Top 0.406: IC1.17 -19.15,-78.68 v-18.26,-77.79
  Bottom 0.406: v-18.26,-77.79 -16.99,-76.52 SV6.3
N$11
  Top 0.406: IC5.24 -20.63,-52.38 -17.62,-49.37 -11.89,-49.37 R13.1
N$13
  Bottom 0.813: R3.S 68.29,-81.57 70.36,-79.5 71.62,-79.5 DIS1.3
N$14  (via drill 2.2)
  other vias: -31.75,-90.17
N$15  (via drill 2.2)
  other vias: 50.8,-90.17
N$16  (via drill 2.2)
  other vias: 44.45,-41.75
N$17  (via drill 0.8 pad 1.27)
  Top 0.406: IC1.16 -19.06,-80.17 v-18.26,-79.38
  Bottom 0.406: v-18.26,-79.38 -17.94,-79.06 SV6.4
N$19  (via drill 2.2)
  other vias: -30.48,-41.91
N$20  (via drill 2.2)
  other vias: 71.69,-90.04
N$21
  Top 0.406: R17.2 58.52,-41.91 LED5.A
N$23  (via drill 0.8)
  Top 0.406: IC1.15 -22.77,-81.22 -22.54,-81.44 v-18.26,-81.44
  Bottom 0.406: SV6.5 -15.4,-81.44 -16.83,-81.44 v-18.26,-81.44
N$24
  Top 0.305: IC5.7 -29.94,-58.2 -30.32,-58.58 -30.32,-65.69 Q4.2
  Top 0.406: C12.2 -16.83,-67.63 -17.62,-68.42 -24.45,-68.42 -27.15,-65.72 Q4.2
N$25
  Top 0.305: C13.2 -21.19,-66.88 Q4.1
  Top 0.406: IC5.8 -29.22,-61.91 -25.4,-65.72 Q4.1
N$26
  Top 0.254: IC1.23 -19.11,-73.88 -17.62,-72.39 -17.62,-70.96 -16.03,-69.37 R4.1
N$27
  Top 0.254: IC1.24 -19.27,-73.08 -18.26,-72.07 -18.26,-70.48 -14.76,-66.99 R11.1
N$30  (via drill 0.8 pad 1.27)
  Top 0.406: IC5.17 -19.63,-59 v-18.26,-57.63
  Bottom 0.406: v-18.26,-57.63 -17.46,-56.83 SV8.3
N$31  (via drill 0.8 pad 1.27)
  Top 0.406: IC5.16 -19.06,-60.49 v-18.26,-59.69
  Bottom 0.406: v-18.26,-59.69 -17.94,-59.37 SV8.4
N$32  (via drill 0.8 pad 1.27)
  Top 0.406: IC5.15 -22.92,-61.37 -22.38,-61.91 v-18.26,-61.91
  Bottom 0.406: v-18.26,-61.91 SV8.5
PWM5
  Bottom 0.406: JP4.2 1.75,-42.7
RESET_ROT  (via drill 0.8, 1)  (1 unrouted)
  Top 0.406: IC5.29 -25.32,-50.88 -26.67,-49.53 v-27.3,-49.53 | IC1.29 -25.16,-70.72 v-26.35,-69.53 -26.51,-69.53 -27.3,-68.74 -32.6,-68.74 R10.1 | v-18.26,-63.34 -19.21,-63.34 -19.68,-62.87 v-25.88,-62.87
  Bottom 0.406: v-27.3,-49.53 -26.67,-49.53 -25.4,-50.8 -25.4,-63.02 | -25.4,-63.02 -25.4,-68.26 -26.19,-69.06 | S1.2 -43.79,-86.49 -41.75,-84.45 -36.51,-84.45 | -36.51,-84.45 -27.78,-84.45 -26.19,-82.87 -26.19,-73.66 | -26.19,-73.66 -26.19,-69.06 | -26.19,-69.06 -26.35,-68.9 | C1.2 -36.4,-84.34 -36.51,-84.45 | SV8.2 -13.97,-54.29 -13.18,-55.09 -13.18,-62.71 -13.97,-63.5 -18.1,-63.5 v-18.26,-63.34 | v-25.88,-62.87 -25.56,-62.87 -25.4,-63.02 | SV6.2 -25.88,-73.98 -26.19,-73.66
ROT1A  (via drill 0.8 pad 1.27)
  Top 0.406: IC1.2 -30.07,-73.88 v-30.8,-74.61 -31.59,-75.41 R21.1
  Bottom 0.406: JP1.2 -34.86,-73.66 -34.23,-74.3 -31.11,-74.3 v-30.8,-74.61
ROT1B  (via drill 0.8 pad 1.27)
  Top 0.406: IC1.32 v-29.84,-71.59 -30.96,-71.59 -31.43,-71.12 R5.1
  Bottom 0.406: JP1.1 -30.32,-71.12 v-29.84,-71.59
ROT2A  (via drill 0.8 pad 1.27)
  Top 0.406: IC1.9 -27.62,-80.23 v-27.62,-81.76 | R22.1 -32.76,-79.32 v-31.75,-80.33
  Bottom 0.254: -41.12,-74.93 -37.15,-74.93
  Bottom 0.406: JP2.2 -41.12,-74.93 | -37.15,-74.93 v-31.75,-80.33 -30.32,-81.76 v-27.62,-81.76
ROT2B  (via drill 0.8 pad 1.27)
  Top 0.406: IC1.1 v-30.96,-73.08 -32.5,-73.08 R7.1
  Bottom 0.254: -41.12,-72.39 -36.2,-72.39
  Bottom 0.406: JP2.1 -41.12,-72.39 | v-30.96,-73.08 -31.65,-72.39 -36.2,-72.39
ROT3A  (via drill 0.8 pad 1.27)
  Top 0.406: IC5.2 -30.07,-54.2 v-31.19,-55.17 -31.75,-55.72 R29.1
  Bottom 0.406: JP3.2 -34.92,-53.98 -33.81,-55.09 -31.11,-55.09 v-31.19,-55.17
ROT3B  (via drill 0.8 pad 1.27)
  Top 0.406: IC5.32 -29.38,-51.91 v-29.69,-51.59 -30,-51.28 -32.6,-51.28 R27.1
  Bottom 0.406: JP3.1 -29.84,-51.44 v-29.69,-51.59
ROT4A  (via drill 0.8 pad 1.27)
  Top 0.406: v-27.78,-61.91 -27.78,-60.55 IC5.9 | R30.1 -32.54,-58.9 v-31.59,-59.69
  Bottom 0.254: -36.2,-55.24 -41.12,-55.24
  Bottom 0.406: JP13.2 -41.12,-55.24 | -28.42,-61.91 v-27.78,-61.91 -29.53,-61.91 -31.59,-59.85 v-31.59,-59.69 -36.2,-55.24
ROT4B  (via drill 0.8 pad 1.27)
  Top 0.406: IC5.1 v-30.96,-53.4 -32.5,-53.4 R28.1
  Bottom 0.254: -41.12,-52.7 -34.92,-52.7
  Bottom 0.406: JP13.1 -41.12,-52.7 | -34.92,-52.7 -34.23,-53.4 v-30.96,-53.4
RX3  (via drill 0.8)
  Top 0.305: Q6.2 21.68,-51.35 R9.1 21.79,-51.44 v22.99,-51.44
  Bottom 0.305: 24.13,-50.48 23.18,-51.44 v22.99,-51.44
  Bottom 0.406: JP11.4 25.4,-42.23 26.99,-43.81 26.99,-45.09 24.13,-47.94 24.13,-50.48
RX_5V  (via drill 0.8)
  Top 0.305: R23.1 15.98,-51.51 Q6.3 16.95,-52.48 v16.95,-55.18
  Bottom 0.305: 16.95,-53.47 v16.95,-55.18
  Bottom 0.406: 16.95,-53.47 16.95,-47.66 18.57,-46.04 24.45,-46.04 25.4,-45.09 JP11.3
SADSA  (1 unrouted)
  Top 1.016: IC2.4 18.84,-66.24 R16.1
SCL1  (via drill 0.8)
  Top 0.406: Q1.2 -41.43,-43.23 R2.1 -42.67,-43.19 v-42.67,-43.05 -42.65,-43.07
  Bottom 0.406: v-42.67,-43.05 -42.67,-42.16 -40.26,-39.75 -29.15,-39.75 JP6.1 JP15.2
SCL_MEGA  (via drill 0.8, 0.8 pad 1.27)
  Top 0.305: Q1.3 -36.02,-41.19 R8.1 -34.44,-41.19 -34.44,-41.26 -31.43,-44.26 -30.16,-44.26 v-28.83,-45.59 | IC5.28 -24.52,-50.09 v-25.08,-49.53
  Top 0.406: IC1.28 -24.36,-69.77 v-24.61,-69.53 | v-7.94,-54.93 -7.94,-57.47 -8.57,-58.1 IC6.6
  Bottom 0.305: -28.07,-45.59 JP15.1 | -25.4,-49.53 v-25.08,-49.53 -22.7,-47.15 -19.68,-47.15
  Bottom 0.406: v-24.61,-69.53 -24.61,-66.36 | -24.61,-66.36 -24.61,-50.01 v-25.08,-49.53 -25.46,-49.53 -26.61,-48.39 -27.43,-48.39 -28.07,-47.75 -28.07,-45.59 v-28.83,-45.59 | -19.68,-47.15 -18.26,-48.58 -11.27,-48.58 -7.94,-51.91 v-7.94,-54.93 | -24.8,-66.17 -24.61,-66.36
SDA1  (via drill 0.8)
  Top 0.406: R1.1 -39.72,-47.04 Q5.2 -39.5,-47.2 v-39.5,-48.58
  Bottom 0.305: -25.91,-43.18 -28.57,-43.18 -29.59,-44.2 -33.91,-44.2
  Bottom 0.406: -25.91,-43.18 -25.72,-43.18 JP6.2 JP15.4 | v-39.5,-48.58 -39.5,-46.8 -36.77,-44.2 -33.91,-44.2 -29.46,-44.2
SDA_MEGA  (via drill 0.8, 0.8 pad 1.27)
  Top 0.305: R6.1 -33.9,-45.16 -32.32,-46.74 -26.67,-46.74 v-26.1,-46.16 JP15.3 | IC5.27 -23.72,-50.55 v-22.7,-49.53 -22.7,-46.13 JP15.3 | JP15.3 -24.32,-44.51
  Top 0.406: R6.1 -36.02,-45.16 Q5.3 | IC1.27 -23.57,-70.4 v-22.7,-69.53 | v-10,-54.93 IC6.5
  Bottom 0.305: v-26.1,-46.16 JP15.3
  Bottom 0.406: v-22.7,-69.53 v-22.7,-49.53 -22.7,-48.74 -22.07,-48.1 -20.16,-48.1 -18.73,-49.53 -12.38,-49.53 -10,-51.91 v-10,-54.93
TX3  (via drill 1)
  Top 0.305: Q2.2 20.64,-47.35 | 20.8,-47.35 21.62,-47.35 R20.1
  Top 0.406: v20.64,-41.91 20.64,-47.35 20.8,-47.35
  Bottom 0.406: JP11.2 v20.64,-41.91
TX_5V  (via drill 0.8)
  Top 0.305: R24.1 15.92,-49.45 Q2.3 16.89,-48.42 v16.89,-45.66
  Bottom 0.406: v16.89,-45.66 17.62,-44.93 22.38,-44.93 JP11.1
VIN
  Bottom 0.813: JP1.3 JP2.3 -43.81,-76.2 -45.56,-77.95 | JP3.3 JP13.3 -43.81,-56.52 -45.56,-58.26 -45.56,-77.95 | -45.56,-77.95 -45.56,-88.74 -41.91,-92.39 -35.81,-92.39 | -34.61,-92.39 -22.86,-92.39 0,-92.39 JP7.1
  Bottom 1.016: -35.81,-92.39 -34.61,-92.39 | JP5.2 -22.86,-92.39
VIN_BAT  (via drill 0.6)
  Top 1.016: 13.34,-85.09 13.34,-83.9 IC4.1 | -6.35,-85.72 -6.35,-85.08 C4.+
  Top 1.27: v-13.34,-85.72 -6.35,-85.72 | IC2.1 13.41,-73.03 v13.34,-73.03
  Top 1.422: -6.35,-85.72 -2.54,-85.72 -1.27,-87 11.43,-87 12.38,-86.04 v12.7,-85.72 13.34,-85.09
  Bottom 1.27: JP5.1 -20.32,-87.63 -18.41,-85.72 v-13.34,-85.72 | v13.34,-73.03 13.34,-85.09 v12.7,-85.72